# EAGLE design MRDT0003A1 (EAGLE 6.2)
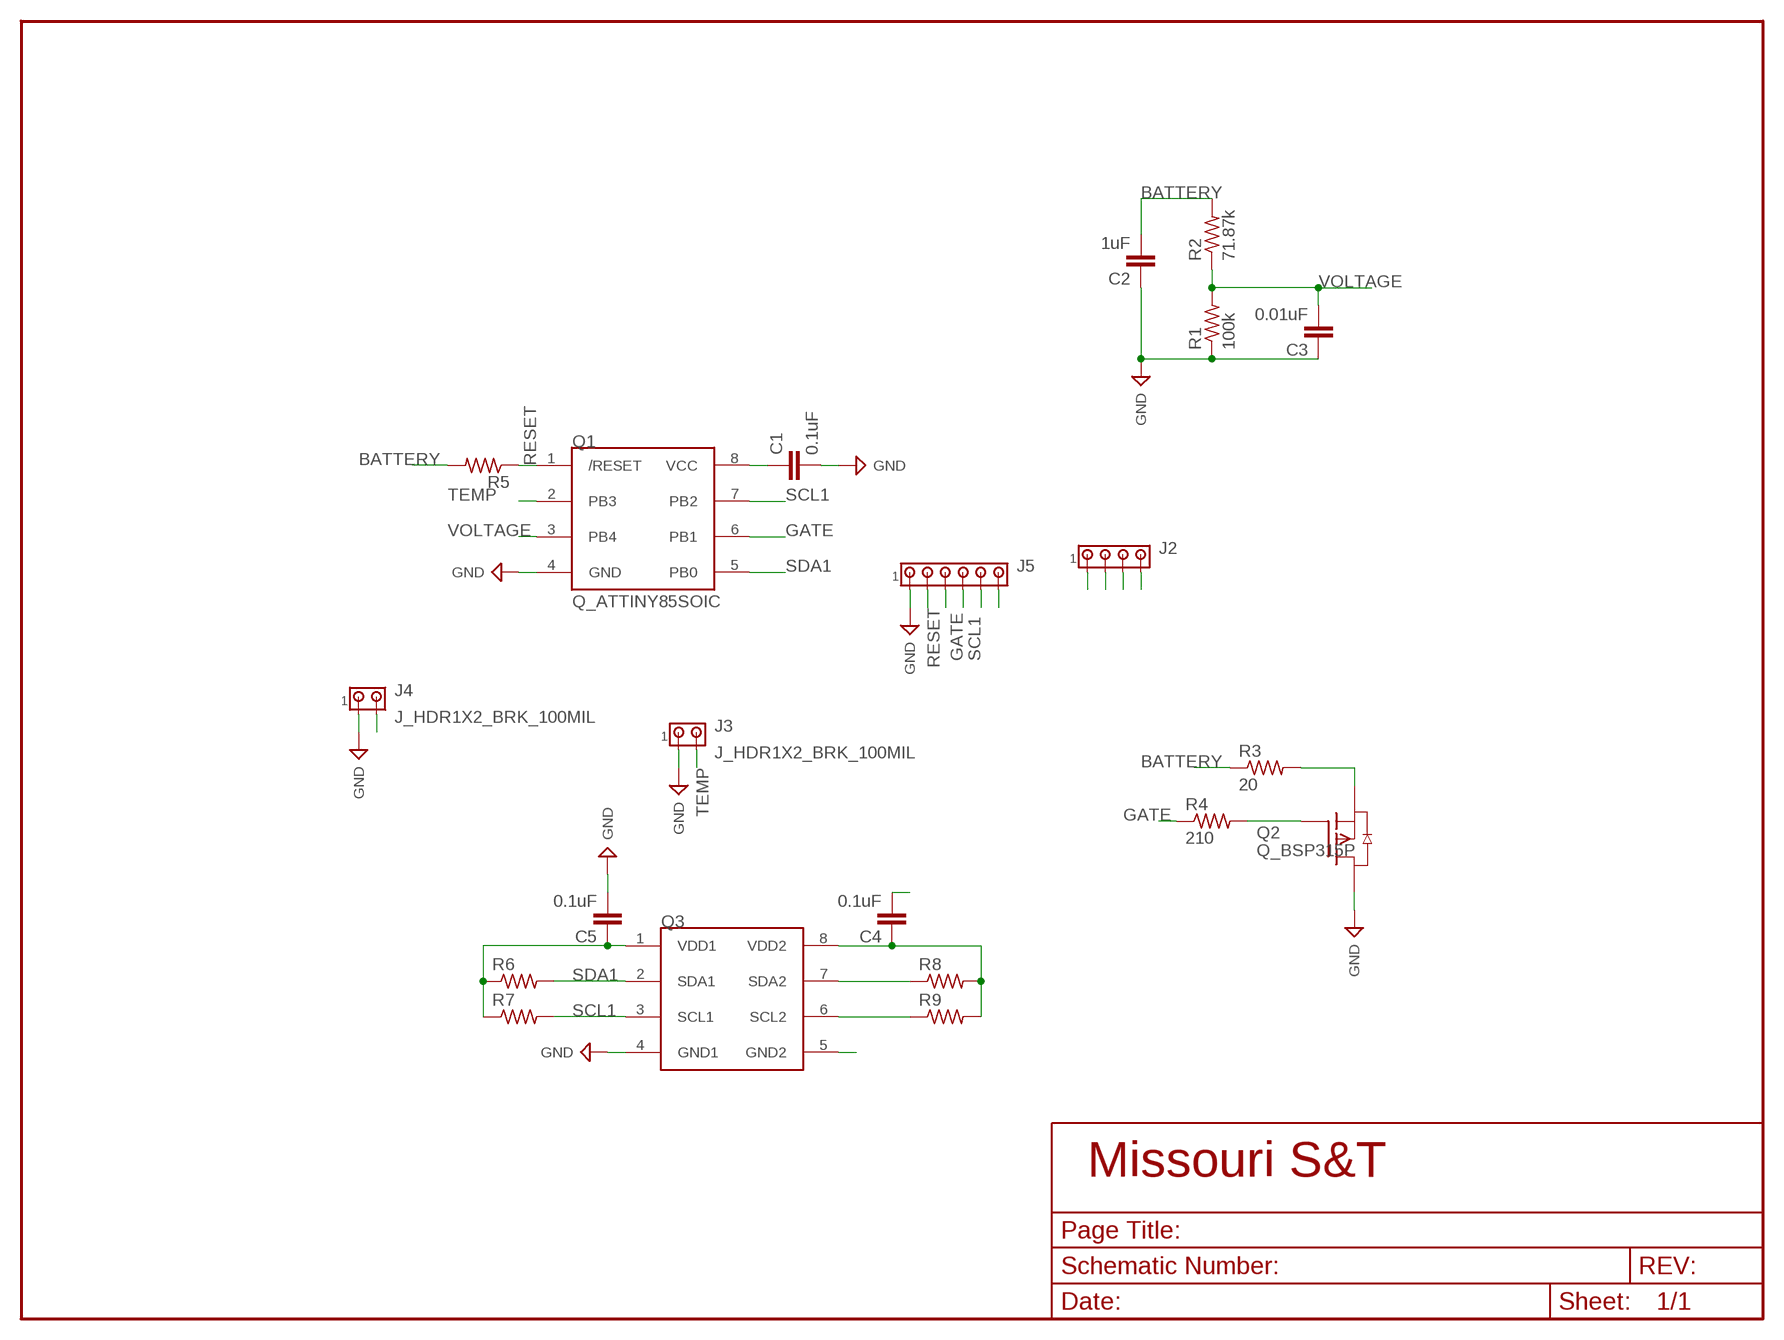
[diagram p0: schematic, sheet 1]

## Parts
C1  0.1uF  C_CAP_0805  [C_0805]
C2  1uF  C_CAP_0805  [C_0805]
C3  0.01uF  C_CAP_0805  [C_0805]
C4  0.1uF  C_CAP_0805  [C_0805]
C5  0.1uF  C_CAP_0805  [C_0805]
J2  J_HDR1X4_BRK_100MIL  [J_BRK1X4_100MIL]
J3  J_HDR1X2_BRK_100MIL  [J_BRK1X2_100MIL]
J4  J_HDR1X2_BRK_100MIL  [J_BRK1X2_100MIL]
J5  J_HDR1X6_BRK_100MIL  [J_BRK1X6_100MIL]
Q1  Q_ATTINY85SOIC  [SOIC8]
Q2  Q_BSP315P  [SOT-223]
Q3  Q_ADUM1250SOIC  [SOIC8]
R1  100k  R_RES_0805  [R_0805]
R2  71.87k  R_RES_0805  [R_0805]
R3  20  R_RES_2010  [R_2010]
R4  210  R_RES_0805  [R_0805]
R5  R_RES_0805  [R_0805]
R6  R_RES_0805  [R_0805]
R7  R_RES_1206  [R_1206]
R8  R_RES_1206  [R_1206]
R9  R_RES_1206  [R_1206]

## Nets
BATTERY: C1.1 C2.2 C5.1 J4.2 J5.6 Q1.8(VCC) Q3.1(VDD1) R2.2 R3.1 R5.2 R6.1 R7.1
GATE: J5.3 Q1.6(PB1) R4.1
GND: C1.2 C2.1 C3.1 C5.2 J3.1 J4.1 J5.1 Q1.4(GND) Q2.2(D) Q3.4(GND1) R1.1 ; supply symbol labelled SUP_GND
GND1: C4.2 J2.1 Q3.5(GND2)
N$2: Q2.1(G) R4.2
N$6: Q2.3(S) R3.2
RESET: J5.2 Q1.1(/RESET) R5.1
SCL1: J5.4 Q1.7(PB2) Q3.3(SCL1) R7.2
SCL2: J2.3 Q3.6(SCL2) R9.1
SDA1: J5.5 Q1.5(PB0) Q3.2(SDA1) R6.2
SDA2: J2.2 Q3.7(SDA2) R8.1
TEMP: J3.2 Q1.2(PB3)
VCC1: C4.1 J2.4 Q3.8(VDD2) R8.2 R9.2
VOLTAGE: C3.2 Q1.3(PB4) R1.2 R2.1

## Library data of the parts
C1-C5 = Lib_Passive:C_CAP
J2 = Lib_Electromechanical:J_HDR1X4: AMP connector
J3 J4 = Lib_Electromechanical:J_HDR1X2
J5 = Lib_Electromechanical:J_HDR1X6: AMP connector
Q1 = Master:Q_ATTINY85: ATTINY85 - MCU, 8bit, 20Mhz, SPI, I2C, PWM, ADC
Q2 = PCB0M1:Q_BSP315P
Q3 = Master:Q_ADUM1250: Isolator for I2C communication
R1-R9 = Lib_Passive:R_RES

## Board
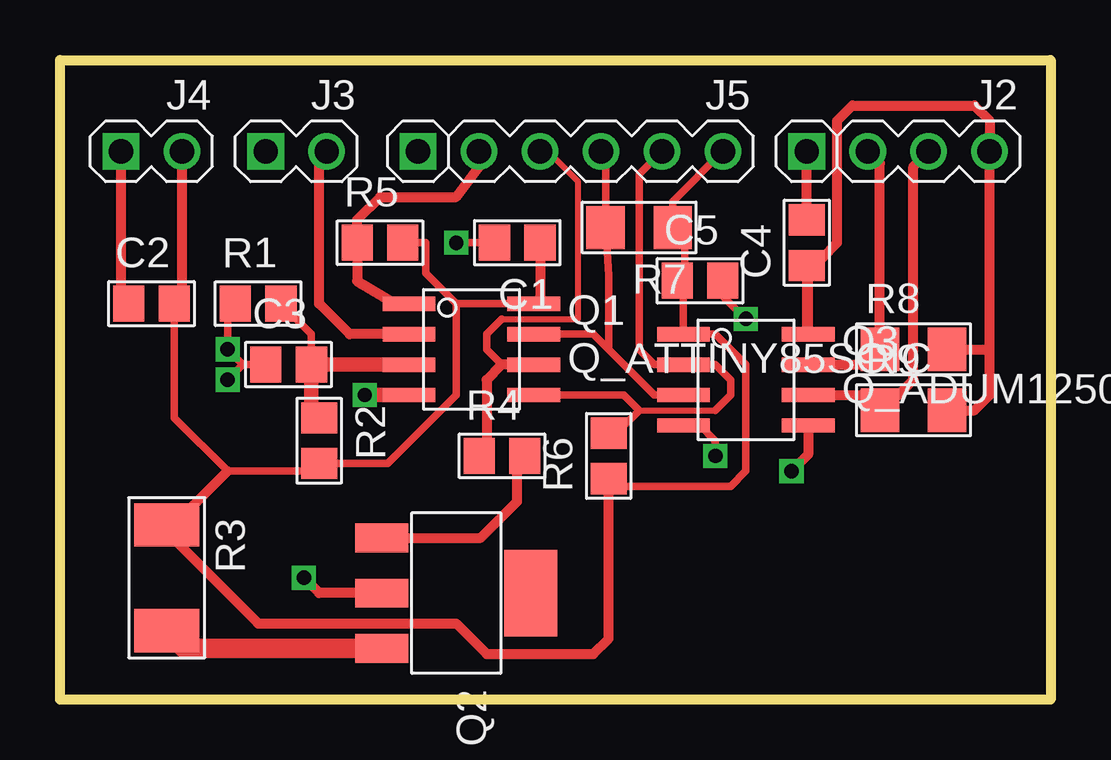
[diagram p1: board, top side]
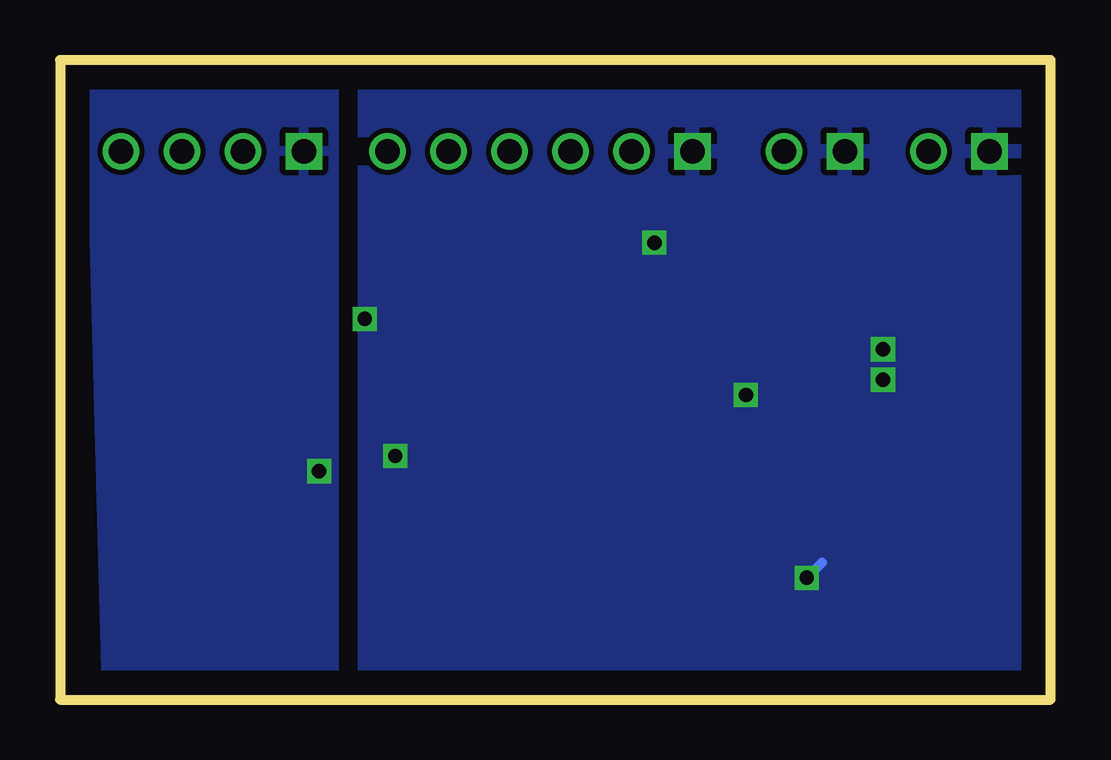
[diagram p2: board, bottom side, seen from below]

Size 41.27 x 26.67 mm. Coordinates in mm from the lower left corner, seen from the top.
Outline: 0,0 0,26.67 41.27,26.67 41.27,0 0,0
Copper layers (1*16): Top 0.035mm / dielectric 1.5mm / Bottom 0.035mm
Design rules: minimum track width 10mil, minimum drill 23mil, track to track 8mil, track to pad 8mil, pad to pad 8mil, via to via 8mil, smd to smd 8mil, copper to edge 40mil, drill to drill 8mil, minimum pad ring 10mil, minimum via ring 8mil, stop-mask expansion 4mil, vias tented up to drill 0mil, thermal gap 10mil

### Footprints (pad centres in the part's own frame; a part is rotated, then mirrored left to right if it is on the bottom)
C_0805 = smd 1.3 x 1.5: 1 -0.95,0; 2 0.95,0
J_BRK1X4_100MIL = drill 1.016 square: 1 3.81,0 | drill 1.016: 2 1.27,0; 3 -1.27,0; 4 -3.81,0
J_BRK1X2_100MIL = drill 1.016 square: 1 1.27,0 | drill 1.016: 2 -1.27,0
J_BRK1X6_100MIL = drill 1.016 square: 1 6.35,0 | drill 1.016: 2 3.81,0; 3 1.27,0; 4 -1.27,0; 5 -3.81,0; 6 -6.35,0
SOIC8 = smd 2.2 x 0.6: 1 -2.6,1.905; 2 -2.6,0.635; 3 -2.6,-0.635; 4 -2.6,-1.905; 5 2.6,-1.905; 6 2.6,-0.635; 7 2.6,0.635; 8 2.6,1.905
SOT-223 = smd 1.2 x 2.2: 1 -2.3,-3.1; 2 0,-3.1; 3 2.3,-3.1 | smd 3.6 x 2.2: 4 0,3.1
R_0805 = smd 1.3 x 1.5: 1 -0.95,0; 2 0.95,0
R_2010 = smd 1.8 x 2.7: 1 -2.2,0; 2 2.2,0
R_1206 = smd 1.6 x 1.8: 1 -1.4,0; 2 1.4,0

### Placement (x,y rotation side)
C1  19.05,19.05 180 top
C2  3.81,16.51 0 top
C3  9.53,13.97 0 top
C4  31.11,19.05 90 top
C5  26.67,17.46 0 top
J2  34.92,22.86 180 top
J3  9.84,22.86 180 top
J4  3.81,22.86 180 top
J5  21.27,22.86 180 top
Q1  17.14,14.61 0 top
Q2  16.51,4.45 270 top
Q3  28.57,13.34 0 top
R1  8.26,16.51 0 top
R2  10.79,10.79 270 top
R3  4.45,5.08 270 top
R4  18.41,10.16 0 top
R5  13.34,19.05 0 top
R6  22.86,10.16 90 top
R7  24.13,19.68 180 top
R8  35.56,14.61 0 top
R9  35.56,12.06 0 top

### Tracks (layer width: path | path; a pad name or v marks a point on that pad's centre or on a via)
BATTERY
  Top 0.305: 16.51,16.51 15.24,17.78 15.24,19.05 R5.2 | 16.51,16.51 Q1.8 | 16.51,16.51 16.51,12.7 13.65,9.85 R2.2 10.47,9.53 6.99,9.53 4.76,11.75 C2.2 | J5.6 25.53,20.77 R7.1 26.04,19.18 26.04,17.78 C5.1 25.98,17.21 Q3.1 27.3,15.24 28.57,13.97 28.57,9.53 27.94,8.89 23.18,8.89 R6.1
  Top 0.406: Q1.8 20,16.77 C1.1 | J4.2 5.08,16.83 C2.2 | R6.1 22.86,2.54 22.23,1.91 17.78,1.91 16.51,3.17 8.26,3.17 4.45,6.99 R3.1 4.74,7.28 6.99,9.53
GATE
  Top 0.254: 18.41,15.88 21.59,15.88 21.59,21.59 20.32,22.86 J5.3
  Top 0.305: 18.41,13.97 17.78,14.61 17.78,15.24 18.41,15.88
  Top 0.406: Q1.6 18.41,13.97 17.78,13.34 17.78,10.47 R4.1
GND  (via drill 0.6)
  Top 0.305: C1.2 v16.51,19.05 | 7.62,13.97 v6.99,14.61 6.99,16.19 R1.1 | C3.1 7.62,13.97 | 7.62,13.97 v6.99,13.34 | Q3.4 26.67,11.43 27.3,10.79 v27.3,10.16 | C5.2 27.62,16.83 v28.57,15.88
  Top 0.406: J4.1 2.54,16.83 C2.1 | Q2.2 10.79,4.45 v10.16,5.08
  Top 0.61: Q1.4 v12.7,12.7
  Bottom 0.406: v10.16,5.08 9.53,5.71
  pour Bottom: 0,26.67 0,0 28.57,0 28.57,26.67
GND1  (via drill 0.6)
  Top 0.406: C4.2 J2.1 | Q3.5 31.18,10.22 v30.48,9.53
  pour Bottom: 29.84,25.4 31.11,26.67 38.73,26.67 40.01,25.4 39.37,1.27 38.1,0 31.11,0 29.84,1.27
N$2
  Top 0.406: 19.45,10.08 R4.2 19.05,9.85 19.05,8.26 17.54,6.75 Q2.1
N$6
  Top 0.813: Q2.3 5.18,2.15 R3.2
RESET
  Top 0.406: Q1.1 13.97,16.51 12.38,17.46 R5.1 12.38,20 13.34,20.95 16.51,20.95 17.46,22.23 J5.2
SCL1
  Top 0.305: Q3.3 24.77,12.7 22.86,14.61 | 22.86,14.61 22.86,17.65 R7.2 22.73,22.67 J5.4 | Q1.7 22.23,15.24 22.86,14.61
SCL2
  Top 0.406: Q3.6 33.52,12.7 | 33.52,12.7 R9.1 | 33.52,12.7 34.92,12.7 35.56,13.34 35.56,22.23 J2.3
SDA1
  Top 0.254: 24.13,12.06 27.3,12.06
  Top 0.305: Q1.5 23.5,12.7 24.13,12.06 23.18,11.11 R6.2 | 27.3,12.06 27.94,12.7 27.94,13.34 27.3,13.97 Q3.2 24.77,13.97 24.13,14.61 24.13,21.91 J5.5
SDA2
  Top 0.406: Q3.7 33.52,13.97 R8.1 34.16,22.36 J2.2
TEMP
  Top 0.406: Q1.2 12.06,15.24 10.79,16.51 10.79,22.23 J3.2
VCC1
  Top 0.406: R8.2 38.73,14.61 | 38.73,14.61 J2.4 38.73,24.13 38.1,24.77 33.02,24.77 32.38,24.13 32.38,19.05 31.75,18.41 31.11,18.41 31.18,18.36 Q3.8 31.11,15.3 C4.1 | R9.2 38.1,12.06 38.73,12.7 38.73,14.61
VOLTAGE
  Top 0.305: C3.2 10.47,15.24 R1.2
  Top 0.61: Q1.3 C3.2 10.47,12.06 R2.1